# Altium project ESP32桌面时钟.PrjPcb
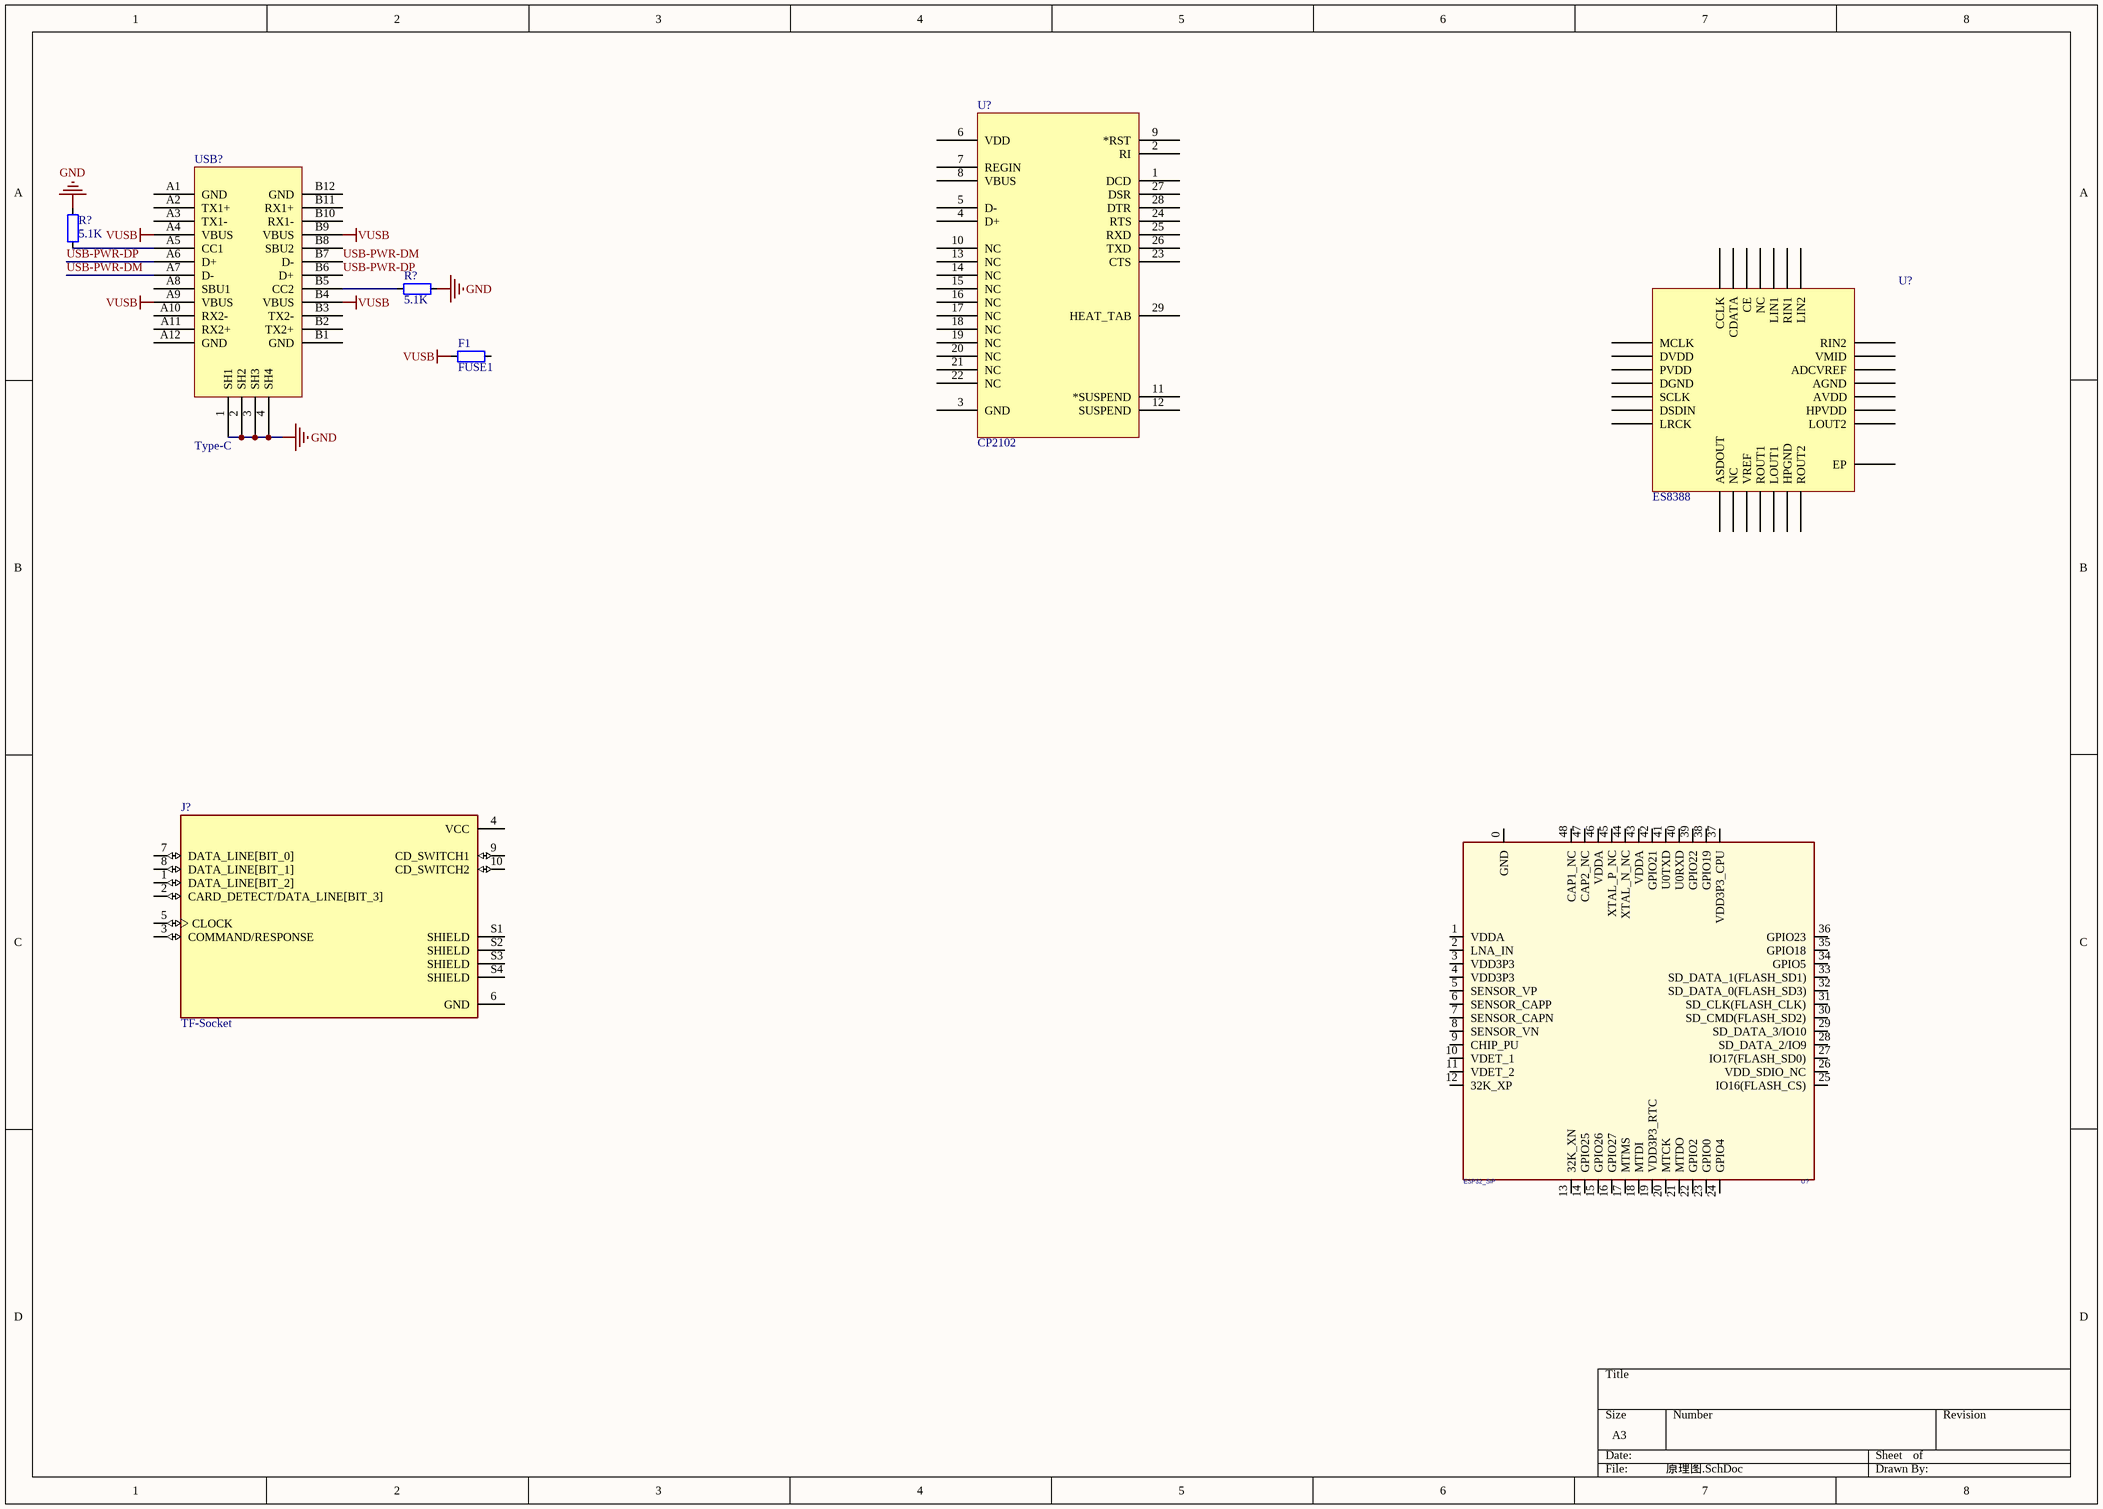
[diagram p0: 原理图.SchDoc]
1 sheet, 8 parts. Net scope: global (net labels, ports and power ports of the same name join across sheets).

## Sheet 原理图.SchDoc
size A3

### Parts
(Parts that share a designator on the sheet are numbered #1, #2 ... from top to bottom, then left to right.)
F1  FUSE1  [RES_0402]
J?  TF-Socket  [TF-Card-Amphenol with TF]
R?#1  5.1K  [RES_0402]
R?#2  5.1K  [RES_0402]
U?#1  CP2102  [QFN-28]
U?#2  ES8388  [QFN_28_4x4]
U?#3  ESP32_SIP  [QFN-48_7X7]
USB?  Type-C  [Type-C-TOP]

### Nets
GND: R?#1.1 R?#2.1 USB?.1(SH1) USB?.2(SH2) USB?.3(SH3) USB?.4(SH4)
VUSB: F1.1 USB?.A4(VBUS) USB?.A9(VBUS) USB?.B4(VBUS) USB?.B9(VBUS)
USB-PWR-DM: USB?.A7(D-) USB?.B7(D-)
USB-PWR-DP: USB?.A6(D+) USB?.B6(D+)
NetR?#1_2: R?#1.2 USB?.A5(CC1)
NetR?#2_2: R?#2.2 USB?.B5(CC2)

Not connected (* = marked no-connect by the designer): F1 2; J? 1(DATA_LINE[BIT_2]) 2(CARD_DETECT/DATA_LINE[BIT_3]) 3(COMMAND/RESPONSE) 4(VCC) 5(CLOCK) 6(GND) 7(DATA_LINE[BIT_0]) 8(DATA_LINE[BIT_1]) 9(CD_SWITCH1) 10(CD_SWITCH2) S1(SHIELD) S2(SHIELD) S3(SHIELD) S4(SHIELD); U?#1 1(DCD) 2(RI) 3(GND) 4(D+) 5(D-) 6(VDD) 7(REGIN) 8(VBUS) 9(*RST) 10(NC) 11(*SUSPEND) 12(SUSPEND) 13(NC) 14(NC) 15(NC) 16(NC) 17(NC) 18(NC) 19(NC) 20(NC) 21(NC) 22(NC) 23(CTS) 24(RTS) 25(RXD) 26(TXD) 27(DSR) 28(DTR) 29(HEAT_TAB); U?#2 1(MCLK) 2(DVDD) 3(PVDD) 4(DGND) 5(SCLK) 6(DSDIN) 7(LRCK) 8(ASDOUT) 9(NC) 10(VREF) 11(ROUT1) 12(LOUT1) 13(HPGND) 14(ROUT2) 15(LOUT2) 16(HPVDD) 17(AVDD) 18(AGND) 19(ADCVREF) 20(VMID) 21(RIN2) 22(LIN2) 23(RIN1) 24(LIN1) 25(NC) 26(CE) 27(CDATA) 28(CCLK) 29(EP); U?#3 0(GND) 1(VDDA) 2(LNA_IN) 3(VDD3P3) 4(VDD3P3) 5(SENSOR_VP) 6(SENSOR_CAPP) 7(SENSOR_CAPN) 8(SENSOR_VN) 9(CHIP_PU) 10(VDET_1) 11(VDET_2) 12(32K_XP) 13(32K_XN) 14(GPIO25) 15(GPIO26) 16(GPIO27) 17(MTMS) 18(MTDI) 19(VDD3P3_RTC) 20(MTCK) 21(MTDO) 22(GPIO2) 23(GPIO0) 24(GPIO4) 25(IO16(FLASH_CS)) 26(VDD_SDIO_NC) 27(IO17(FLASH_SD0)) 28(SD_DATA_2/IO9) 29(SD_DATA_3/IO10) 30(SD_CMD(FLASH_SD2)) 31(SD_CLK(FLASH_CLK)) 32(SD_DATA_0(FLASH_SD3)) 33(SD_DATA_1(FLASH_SD1)) 34(GPIO5) 35(GPIO18) 36(GPIO23) 37(VDD3P3_CPU) 38(GPIO19) 39(GPIO22) 40(U0RXD) 41(U0TXD) 42(GPIO21) 43(VDDA) 44(XTAL_N_NC) 45(XTAL_P_NC) 46(VDDA) 47(CAP2_NC) 48(CAP1_NC); USB? A1(GND) A2(TX1+) A3(TX1-) A8(SBU1) A10(RX2-) A11(RX2+) A12(GND) B1(GND) B2(TX2+) B3(TX2-) B8(SBU2) B10(RX1-) B11(RX1+) B12(GND)

### Library data of the parts
F1 R?#1 R?#2 = 电阻-0402: Resistor; Value: 22R
J? = TF-Socket: 10 _8 + 2_ Position Card Connector Secure Digital - microSDâ„¢ Surface Mount, Right Angle Gold; MP: 1140084168; MF: Amphenol Commercial Products; SnapEDA_Link: https://www.snapeda.com/parts/1140084168/Amphenol/view-part/4544529/?ref=snap; Availability: Unavailable; Price: None; Value: *; Package: None
U?#1 = CP2102: USB转TTL; PART DESC: SINGLE-CHIP USB TO UART BRIDGE, QFN28, RoHS.; MFG #1: SILICON LABS; PART NUMBER: CP2102; Value: Value; RefDes: RefDes; Type: DEV
U?#3 = ESP32-PICO
USB? = USB-Type-C-TOP